# EAGLE design headstage (EAGLE 7.2.0)
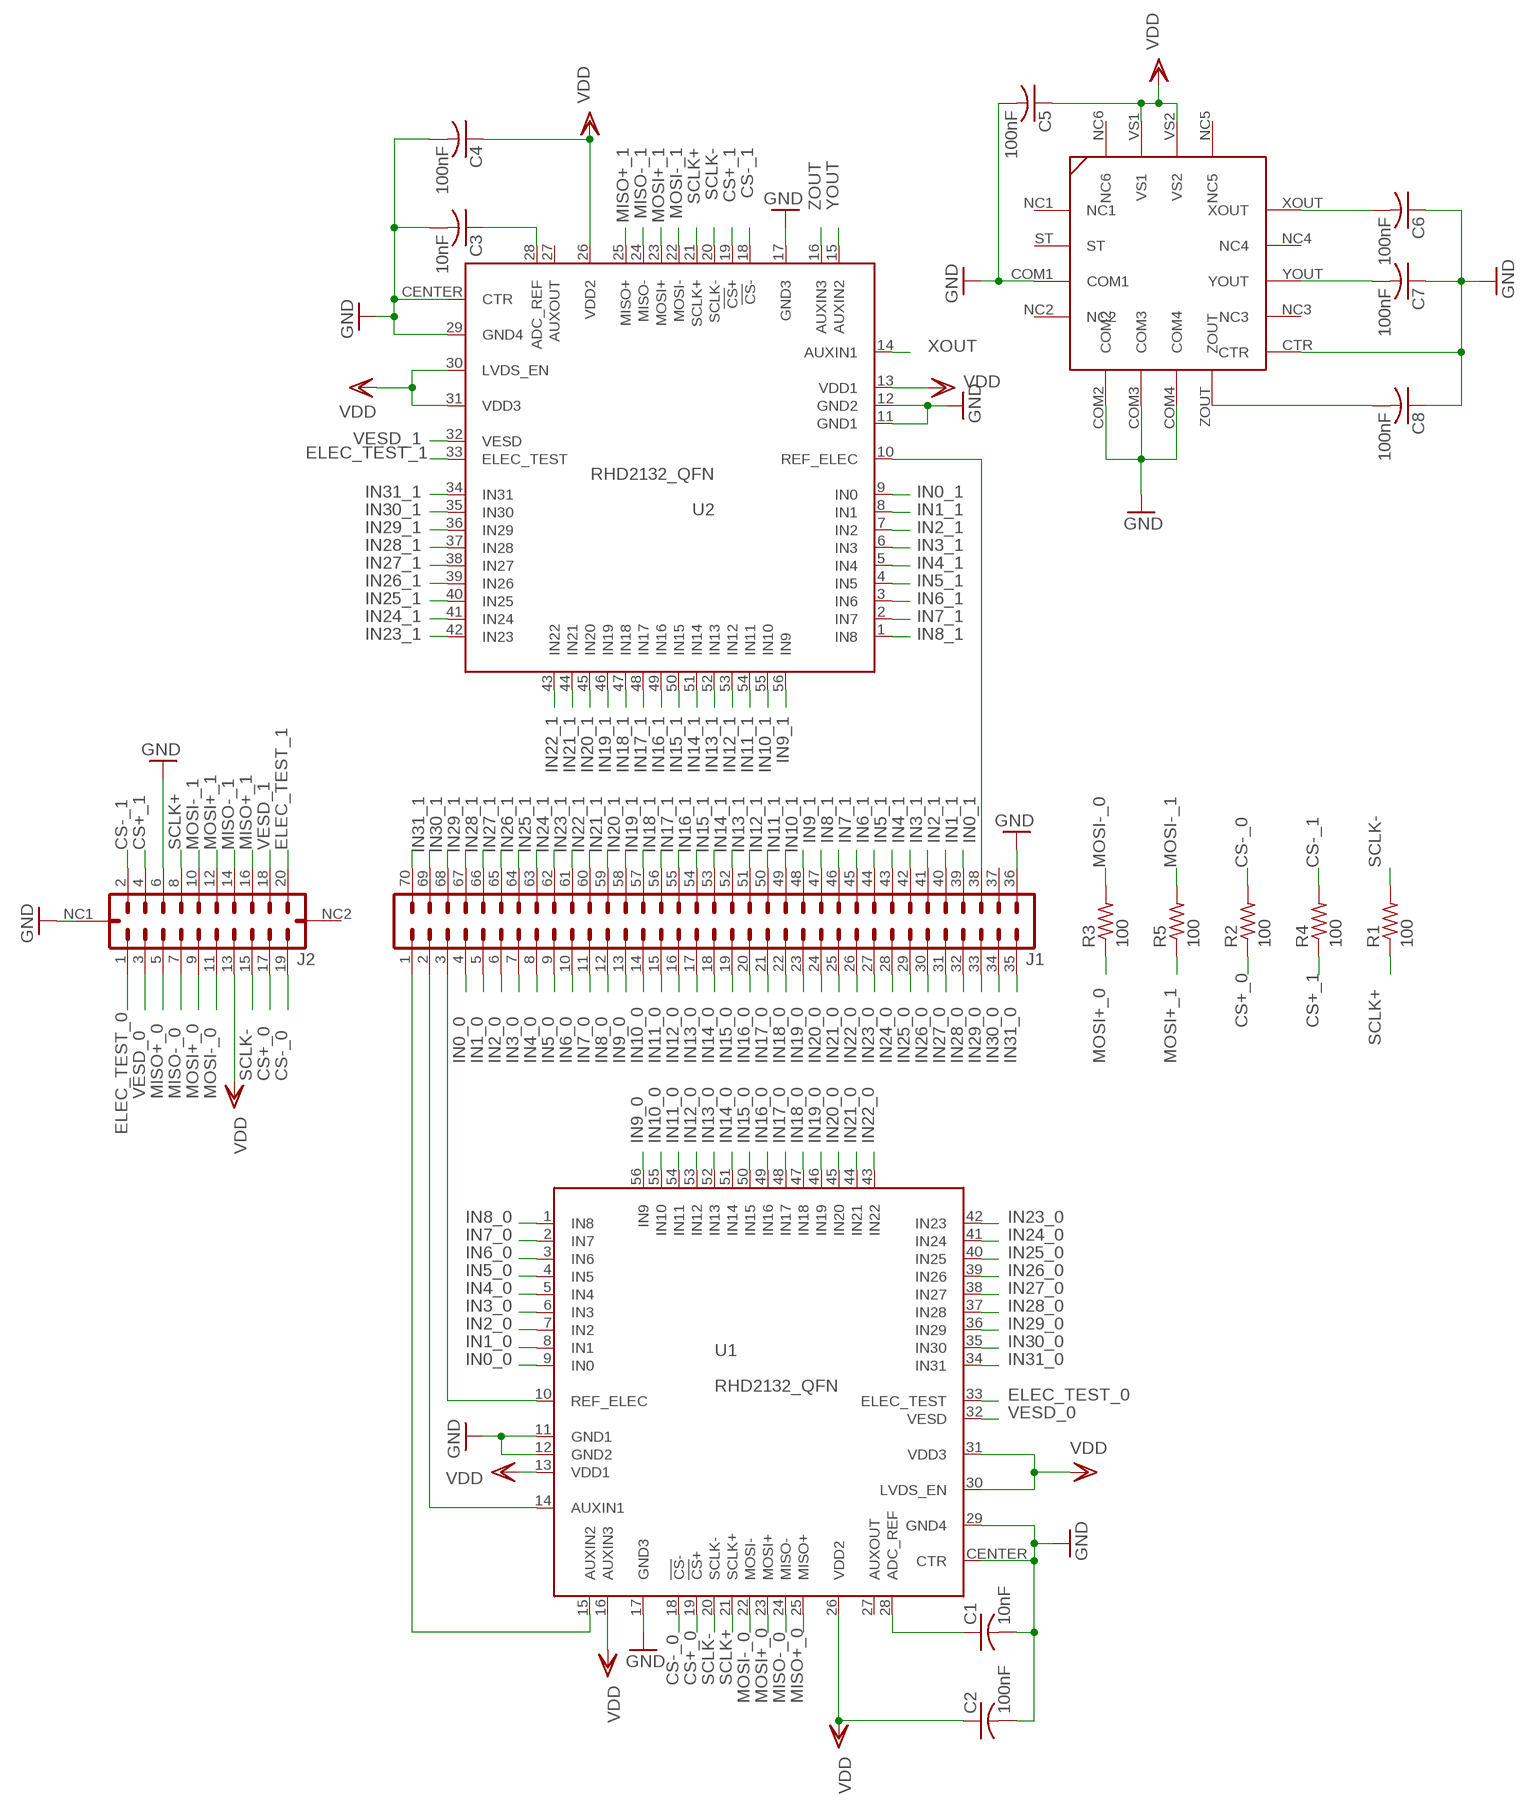
[diagram p0: schematic, sheet 1]

## Parts
C1  10nF  C-USC0402K  [C0402K]
C2  100nF  C-USC0402K  [C0402K]
C3  10nF  C-USC0402K  [C0402K]
C4  100nF  C-USC0402K  [C0402K]
C5  100nF  C-USC0402K  [C0402K]
C6  100nF  C-USC0402K  [C0402K]
C7  100nF  C-USC0402K  [C0402K]
C8  100nF  C-USC0402K  [C0402K]
J1  HIROSE_DF40C-70DS-0.4V(51)  HIROSE_DF40-70DP  [HIROSE_DF40C-70DP]
J2  MOLEX_501190-2017  [MOLEX_501190-2017]
R1  100  R-US_R0402  [R0402]
R2  100  R-US_R0402  [R0402]
R3  100  R-US_R0402  [R0402]
R4  100  R-US_R0402  [R0402]
R5  100  R-US_R0402  [R0402]
U1  RHD2132_QFN  [QFN56_8_X_8_LARGE]
U2  RHD2132_QFN  [QFN56_8_X_8_LARGE]
U3  ADXL335  [ADXL335]

## Nets
CS+_0: J2.17 R2.1 U1.19(!CS!+)
CS+_1: J2.4 R4.1 U2.19(!CS!+)
CS-_0: J2.19 R2.2 U1.18(!CS!-)
CS-_1: J2.2 R4.2 U2.18(!CS!-)
ELEC_TEST_0: J2.1 U1.33(ELEC_TEST)
ELEC_TEST_1: J2.20 U2.33(ELEC_TEST)
GND: C1.2 C2.2 C3.2 C4.2 C5.2 C6.1 C7.1 C8.1 J1.36 J2.6 J2.NC1 U1.11(GND1) U1.12(GND2) U1.17(GND3) U1.29(GND4) U1.CENTER(CTR) U2.11(GND1) U2.12(GND2) U2.17(GND3) U2.29(GND4) U2.CENTER(CTR) U3.COM1 U3.COM2 U3.COM3 U3.COM4 U3.CTR
IN0_0: J1.4 U1.9(IN0)
IN0_1: J1.39 U2.9(IN0)
IN1_0: J1.5 U1.8(IN1)
IN1_1: J1.40 U2.8(IN1)
IN2_0: J1.6 U1.7(IN2)
IN2_1: J1.41 U2.7(IN2)
IN3_0: J1.7 U1.6(IN3)
IN3_1: J1.42 U2.6(IN3)
IN4_0: J1.8 U1.5(IN4)
IN4_1: J1.43 U2.5(IN4)
IN5_0: J1.9 U1.4(IN5)
IN5_1: J1.44 U2.4(IN5)
IN6_0: J1.10 U1.3(IN6)
IN6_1: J1.45 U2.3(IN6)
IN7_0: J1.11 U1.2(IN7)
IN7_1: J1.46 U2.2(IN7)
IN8_0: J1.12 U1.1(IN8)
IN8_1: J1.47 U2.1(IN8)
IN9_0: J1.13 U1.56(IN9)
IN9_1: J1.48 U2.56(IN9)
IN10_0: J1.14 U1.55(IN10)
IN10_1: J1.49 U2.55(IN10)
IN11_0: J1.15 U1.54(IN11)
IN11_1: J1.50 U2.54(IN11)
IN12_0: J1.16 U1.53(IN12)
IN12_1: J1.51 U2.53(IN12)
IN13_0: J1.17 U1.52(IN13)
IN13_1: J1.52 U2.52(IN13)
IN14_0: J1.18 U1.51(IN14)
IN14_1: J1.53 U2.51(IN14)
IN15_0: J1.19 U1.50(IN15)
IN15_1: J1.54 U2.50(IN15)
IN16_0: J1.20 U1.49(IN16)
IN16_1: J1.55 U2.49(IN16)
IN17_0: J1.21 U1.48(IN17)
IN17_1: J1.56 U2.48(IN17)
IN18_0: J1.22 U1.47(IN18)
IN18_1: J1.57 U2.47(IN18)
IN19_0: J1.23 U1.46(IN19)
IN19_1: J1.58 U2.46(IN19)
IN20_0: J1.24 U1.45(IN20)
IN20_1: J1.59 U2.45(IN20)
IN21_0: J1.25 U1.44(IN21)
IN21_1: J1.60 U2.44(IN21)
IN22_0: J1.26 U1.43(IN22)
IN22_1: J1.61 U2.43(IN22)
IN23_0: J1.27 U1.42(IN23)
IN23_1: J1.62 U2.42(IN23)
IN24_0: J1.28 U1.41(IN24)
IN24_1: J1.63 U2.41(IN24)
IN25_0: J1.29 U1.40(IN25)
IN25_1: J1.64 U2.40(IN25)
IN26_0: J1.30 U1.39(IN26)
IN26_1: J1.65 U2.39(IN26)
IN27_0: J1.31 U1.38(IN27)
IN27_1: J1.66 U2.38(IN27)
IN28_0: J1.32 U1.37(IN28)
IN28_1: J1.67 U2.37(IN28)
IN29_0: J1.33 U1.36(IN29)
IN29_1: J1.68 U2.36(IN29)
IN30_0: J1.34 U1.35(IN30)
IN30_1: J1.69 U2.35(IN30)
IN31_0: J1.35 U1.34(IN31)
IN31_1: J1.70 U2.34(IN31)
MISO+_0: J2.5 U1.25(MISO+)
MISO+_1: J2.16 U2.25(MISO+)
MISO-_0: J2.7 U1.24(MISO-)
MISO-_1: J2.14 U2.24(MISO-)
MOSI+_0: J2.9 R3.1 U1.23(MOSI+)
MOSI+_1: J2.12 R5.1 U2.23(MOSI+)
MOSI-_0: J2.11 R3.2 U1.22(MOSI-)
MOSI-_1: J2.10 R5.2 U2.22(MOSI-)
N$1: J1.1 U1.15(AUXIN2)
N$2: J1.2 U1.14(AUXIN1)
N$3: C1.1 U1.28(ADC_REF)
N$6: C3.1 U2.28(ADC_REF)
REF_ELEC_0: J1.3 U1.10(REF_ELEC)
REF_ELEC_1: J1.38 U2.10(REF_ELEC)
SCLK+: J2.8 R1.1 U1.21(SCLK+) U2.21(SCLK+)
SCLK-: J2.15 R1.2 U1.20(SCLK-) U2.20(SCLK-)
VDD: C2.1 C4.1 C5.1 J2.13 U1.13(VDD1) U1.16(AUXIN3) U1.26(VDD2) U1.30(LVDS_EN) U1.31(VDD3) U2.13(VDD1) U2.26(VDD2) U2.30(LVDS_EN) U2.31(VDD3) U3.VS1 U3.VS2
VESD_0: J2.3 U1.32(VESD)
VESD_1: J2.18 U2.32(VESD)
XOUT: C6.2 U2.14(AUXIN1) U3.XOUT
YOUT: C7.2 U2.15(AUXIN2) U3.YOUT
ZOUT: C8.2 U2.16(AUXIN3) U3.ZOUT
Unconnected: J1.37 J2.NC2 U1.27(AUXOUT) U2.27(AUXOUT) U3.NC1 U3.NC2 U3.NC3 U3.NC4 U3.NC5 U3.NC6 U3.ST

## Library data of the parts
C1-C8 = rcl:C-US: CAPACITOR, American symbol
J1 = rpoddar:HIROSE_DF40-70DP
J2 = rpoddar:MOLEX_501190-2017
R1-R5 = rcl:R-US_: RESISTOR, American symbol
U1 U2 = RHD2000:RHD2132
U3 = rpoddar:ADXL335: The ADXL335 is a small, thin, low power, complete 3-axis accelerometer with signal conditioned voltage outputs. The product measures acceleration with a minimum full-scale range of ±3 g. It can measure the static acceleration of gravity in tilt-sensing applications, as well as dynamic acceleration resulting from motion, shock, or vibration. The user selects the bandwidth of the accelerometer using the CX, CY, and CZ capacitors at the XOUT, YOUT, and ZOUT pins. Bandwidths can be selected to suit the application, with a range of 0.5 Hz to 1600 Hz for the X and Y axes, and a range of 0.5 Hz to 550 Hz for the Z axi

## Net classes
0 default: drill 0.203 mm

## Board
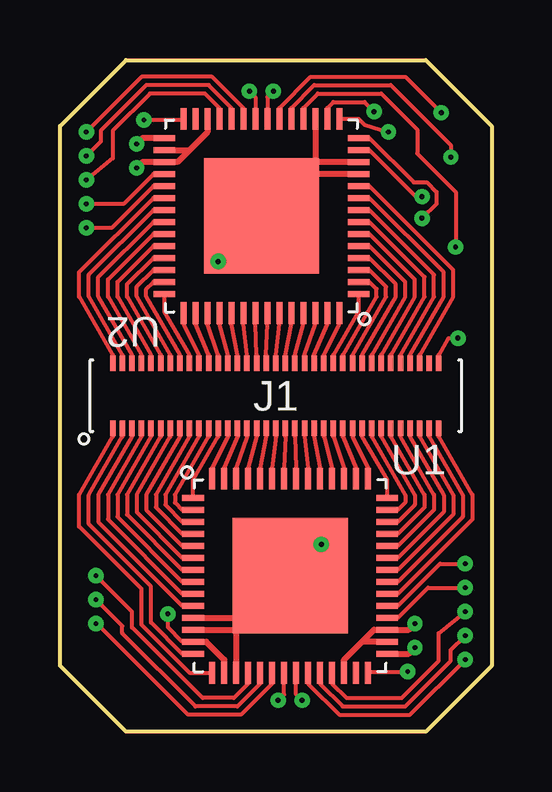
[diagram p1: board, top side]
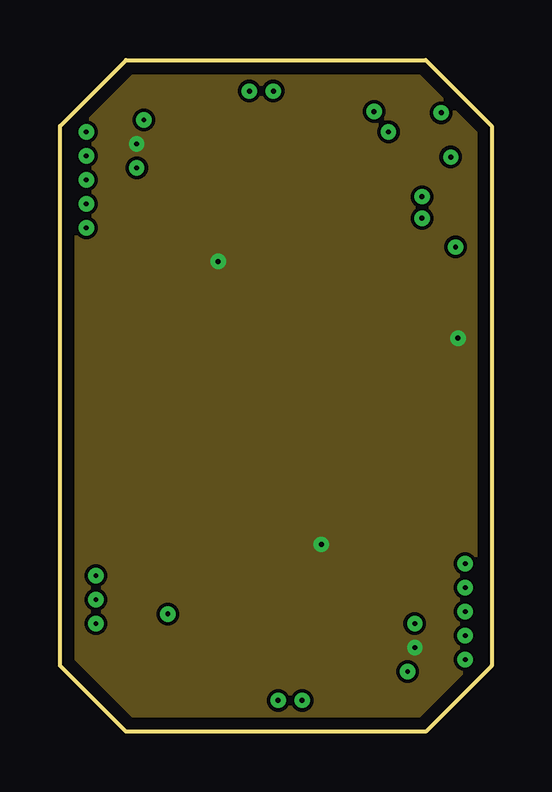
[diagram p2: board, inner layer $GND]
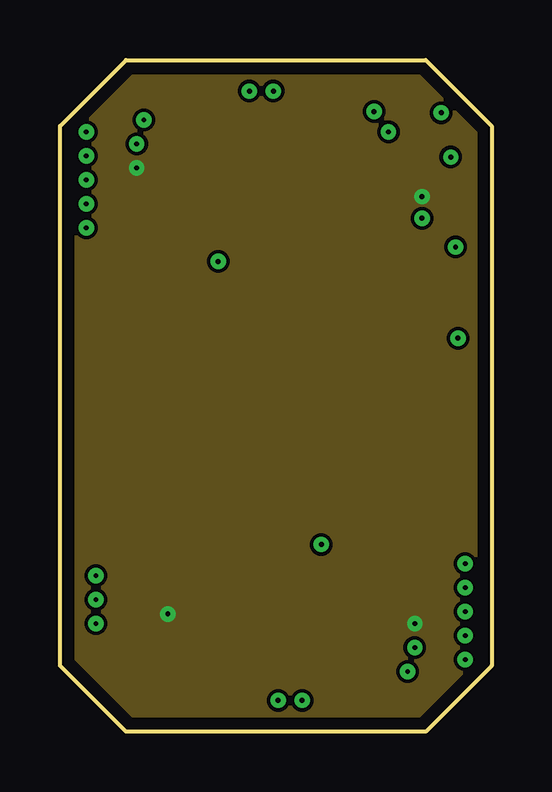
[diagram p3: board, inner layer $VDD]
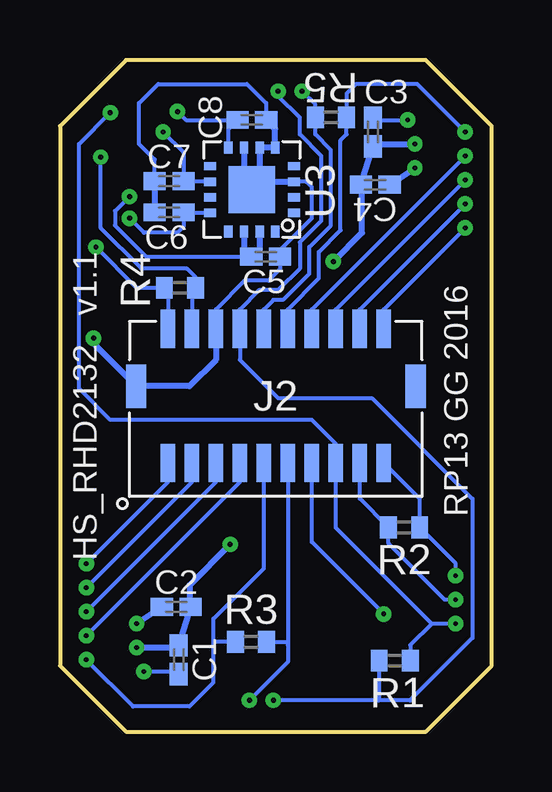
[diagram p4: board, bottom side, seen from below]

Size 18 x 28 mm. Coordinates in mm from the lower left corner, seen from the top.
Outline: 0,2.75 0,25.25 2.75,28 15.25,28 18,25.25 18,2.75 15.25,0 2.75,0 0,2.75
Copper layers (1+2*15+16): Top 0.0178mm / dielectric 12mil / $GND 0.0356mm / dielectric 28mil / $VDD 0.0356mm / dielectric 12mil / Bottom 0.0178mm
Design rules "SSC-EAGLE-4Lyr_v1.0.0.3 *": minimum track width 6mil, minimum drill 8mil, track to track 6mil, track to pad 6mil, pad to pad 6mil, via to via 6mil, smd to smd 6mil, copper to edge 20mil, drill to drill 16mil, minimum pad ring 8mil, minimum via ring 8mil, stop-mask expansion 3mil, vias tented up to drill 0mil, thermal gap 10mil

### Footprints (pad centres in the part's own frame; a part is rotated, then mirrored left to right if it is on the bottom)
C0402K = smd 0.925 x 0.74: 1 -0.6,0; 2 0.6,0
HIROSE_DF40C-70DP = smd 0.23 x 0.66: 1 -6.8,-1.355; 2 -6.4,-1.355; 3 -6,-1.355; 4 -5.6,-1.355; 5 -5.2,-1.355; 6 -4.8,-1.355; 7 -4.4,-1.355; 8 -4,-1.355; 9 -3.6,-1.355; 10 -3.2,-1.355; 11 -2.8,-1.355; 12 -2.4,-1.355; 13 -2,-1.355; 14 -1.6,-1.355; 15 -1.2,-1.355; 16 -0.8,-1.355; 17 -0.4,-1.355; 18 0,-1.355; 19 0.4,-1.355; 20 0.8,-1.355; 21 1.2,-1.355; 22 1.6,-1.355; 23 2,-1.355; 24 2.4,-1.355; 25 2.8,-1.355; 26 3.2,-1.355; 27 3.6,-1.355; 28 4,-1.355; 29 4.4,-1.355; 30 4.8,-1.355; 31 5.2,-1.355; 32 5.6,-1.355; 33 6,-1.355; 34 6.4,-1.355; 35 6.8,-1.355; 36 6.8,1.355; 37 6.4,1.355; 38 6,1.355; 39 5.6,1.355; 40 5.2,1.355; 41 4.8,1.355; 42 4.4,1.355; 43 4,1.355; 44 3.6,1.355; 45 3.2,1.355; 46 2.8,1.355; 47 2.4,1.355; 48 2,1.355; 49 1.6,1.355; 50 1.2,1.355; 51 0.8,1.355; 52 0.4,1.355; 53 0,1.355; 54 -0.4,1.355; 55 -0.8,1.355; 56 -1.2,1.355; 57 -1.6,1.355; 58 -2,1.355; 59 -2.4,1.355; 60 -2.8,1.355; 61 -3.2,1.355; 62 -3.6,1.355; 63 -4,1.355; 64 -4.4,1.355; 65 -4.8,1.355; 66 -5.2,1.355; 67 -5.6,1.355; 68 -6,1.355; 69 -6.4,1.355; 70 -6.8,1.355
MOLEX_501190-2017 = smd 0.6 x 1.6: 1 -4.5,-2.8; 2 -4.5,2.8; 3 -3.5,-2.8; 4 -3.5,2.8; 5 -2.5,-2.8; 6 -2.5,2.8; 7 -1.5,-2.8; 8 -1.5,2.8; 9 -0.5,-2.8; 10 -0.5,2.8; 11 0.5,-2.8; 12 0.5,2.8; 13 1.5,-2.8; 14 1.5,2.8; 15 2.5,-2.8; 16 2.5,2.8; 17 3.5,-2.8; 18 3.5,2.8; 19 4.5,-2.8; 20 4.5,2.8 | smd 0.85 x 1.8: NC1 -5.825,0.4; NC2 5.825,0.4
R0402 = smd 0.7 x 0.9: 1 -0.65,0; 2 0.65,0
QFN56_8_X_8_LARGE = smd 0.9 x 0.25: 1 -4.05,3.25; 2 -4.05,2.75; 3 -4.05,2.25; 4 -4.05,1.75; 5 -4.05,1.25; 6 -4.05,0.75; 7 -4.05,0.25; 8 -4.05,-0.25; 9 -4.05,-0.75; 10 -4.05,-1.25; 11 -4.05,-1.75; 12 -4.05,-2.25; 13 -4.05,-2.75; 14 -4.05,-3.25; 29 4.05,-3.25; 30 4.05,-2.75; 31 4.05,-2.25; 32 4.05,-1.75; 33 4.05,-1.25; 34 4.05,-0.75; 35 4.05,-0.25; 36 4.05,0.25; 37 4.05,0.75; 38 4.05,1.25; 39 4.05,1.75; 40 4.05,2.25; 41 4.05,2.75; 42 4.05,3.25 | smd 0.25 x 0.9: 15 -3.25,-4.05; 16 -2.75,-4.05; 17 -2.25,-4.05; 18 -1.75,-4.05; 19 -1.25,-4.05; 20 -0.75,-4.05; 21 -0.25,-4.05; 22 0.25,-4.05; 23 0.75,-4.05; 24 1.25,-4.05; 25 1.75,-4.05; 26 2.25,-4.05; 27 2.75,-4.05; 28 3.25,-4.05; 43 3.25,4.05; 44 2.75,4.05; 45 2.25,4.05; 46 1.75,4.05; 47 1.25,4.05; 48 0.75,4.05; 49 0.25,4.05; 50 -0.25,4.05; 51 -0.75,4.05; 52 -1.25,4.05; 53 -1.75,4.05; 54 -2.25,4.05; 55 -2.75,4.05; 56 -3.25,4.05 | smd 4.8 x 4.8: CENTER 0,0
ADXL335 = smd 0.5 x 0.35: COM1 -1.75,-0.325; NC1 -1.75,0.975; NC2 -1.75,-0.975; NC3 1.75,-0.975; NC4 1.75,0.325; ST -1.75,0.325; XOUT 1.75,0.975; YOUT 1.75,-0.325 | smd 0.35 x 0.5: COM2 -0.975,-1.75; COM3 -0.325,-1.75; COM4 0.325,-1.75; NC5 0.975,1.75; NC6 -0.975,1.75; VS1 0.325,1.75; VS2 -0.325,1.75; ZOUT 0.975,-1.75 | smd 1.95 x 1.95: CTR 0,0

### Placement (x,y rotation side)
C1  13.05,3 90 bottom
C2  13.15,5.2 0 bottom
C3  4.95,25 270 bottom
C4  4.85,22.8 180 bottom
C5  9.42,19.8 0 bottom
C6  13.45,21.65 0 bottom
C7  13.45,22.95 0 bottom
C8  10,25.5 180 bottom
J1  9,14 0 top
J2  9,14 0 bottom
R1  4.04,2.96 0 bottom
R2  3.65,8.51 0 bottom
R3  10.03,3.74 0 bottom
R4  13,18.5 180 bottom
R5  6.7,25.6 180 bottom
U1  9.6,6.5 0 top
U2  8.4,21.5 180 top
U3  10,22.6 180 bottom

### Tracks (layer width: path | path; a pad name or v marks a point on that pad's centre or on a via)
CS+_0  (via drill 0.2 pad 0.64)
  Top 0.175: U1.19 8.35,2 7.4,1.05 5.65,1.05 2.6,4.1 2.6,4.4 v1.5,5.5
  Bottom 0.175: v1.5,5.5 1.95,5.5 4.3,7.85 R2.1 5.5,9.71 J2.17
CS+_1  (via drill 0.2 pad 0.64)
  Top 0.175: U2.19 9.65,26 10.6,26.95 13.8,26.95 16.3,24.45 v16.3,23.95
  Bottom 0.175: J2.4 12.5,18.35 R4.1 12.35,18.95 12.7,19.3 14.6,19.3 16.3,21 v16.3,23.95
CS-_0  (via drill 0.2 pad 0.64)
  Top 0.175: U1.18 7.85,2 7.25,1.4 5.95,1.4 3,4.34 3,5 v1.5,6.5
  Bottom 0.175: v1.5,6.5 1.5,7.01 R2.2 3,9.7 J2.19
CS-_1  (via drill 0.2 pad 0.64)
  Top 0.175: U2.18 10.15,26 10.75,26.6 13.4,26.6 14.9,25.1 14.9,24.1 16.5,22.5 v16.5,20.2
  Bottom 0.175: J2.2 13.5,18.35 R4.2 14.8,18.5 v16.5,20.2
ELEC_TEST_0  (via drill 0.2 pad 0.64)
  Top 0.175: U1.33 14.1,5.25 15.85,7 v16.9,7
  Bottom 0.175: v16.9,7 13.5,10.4 J2.1
ELEC_TEST_1  (via drill 0.2 pad 0.64)
  Top 0.175: U2.33 3.9,22.75 2.15,21 v1.1,21
  Bottom 0.175: v1.1,21 4.5,17.6 J2.20
GND  (via drill 0.2 pad 0.64)
  Top 0.175: J1.36 15.8,15.7 16.2,16.4 v16.6,16.4
  Top 0.25: U1.11 7.85,4.75 U1.CENTER | U1.12 7.35,4.25 | 7.35,4.25 U1.CENTER | 7.35,4.25 U1.17 | U2.17 10.65,23.75 | U2.12 10.65,23.75 | 10.65,23.75 U2.CENTER | U2.11 10.15,23.25 U2.CENTER | U1.29 14.55,3.25 v14.8,3.5 | U2.29 3.45,24.75 v3.2,24.5 | v10.9,7.8 U1.CENTER | U2.CENTER v6.6,19.6
  Bottom 0.175: C1.2 13.15,3.5 | C3.2 4.85,24.5 | J2.6 11.5,17.6 10.3,18.8 9.3,18.8 8.82,19.28 C5.2 8.82,20.08 7.5,21.4 7.5,22.7 7.72,22.93 U3.COM1 | C7.1 14.05,23.85 14.7,24.5 14.7,26.2 13.9,27 10.2,27 9.4,26.2 C8.1
  Bottom 0.25: 13.15,3.5 v14.8,3.5 | C2.2 C1.2 | 4.85,24.5 v3.2,24.5 | C4.2 C3.2 | J2.6 11.5,15.5 12.6,14.4 J2.NC1 16.6,16.18 v16.6,16.4 | v10.9,7.8 12.6,6.1 12.6,5.2 | v6.6,19.6 5.4,20.8 5.4,22.8 | 10.7,22.5 arc-90 U3.CTR | 9.7,22.9 U3.CTR | C7.1 C6.1 | C8.1 9.03,25.12 U3.COM2 U3.COM3 9.68,22.93 U3.CTR | U3.COM4 10.32,22.93 | 10.32,22.93 U3.CTR | 10.32,22.93 U3.COM1
  pour $GND: 0,0 0,28 18,28 18,0
IN0_0
  Top 0.175: J1.4 3.4,12.3 2,9.87 2,8.85 5.1,5.75 U1.9
IN0_1
  Top 0.175: J1.39 14.6,15.7 16,18.13 16,19.15 12.9,22.25 U2.9
IN1_0
  Top 0.175: J1.5 3.8,12.3 2.4,9.87 2.4,8.95 5.1,6.25 U1.8
IN1_1
  Top 0.175: J1.40 14.2,15.7 15.6,18.13 15.6,19.05 12.9,21.75 U2.8
IN2_0
  Top 0.175: J1.6 4.2,12.3 2.8,9.87 2.8,9.05 5.1,6.75 U1.7
IN2_1
  Top 0.175: J1.41 13.8,15.7 15.2,18.13 15.2,18.95 12.9,21.25 U2.7
IN3_0
  Top 0.175: J1.7 4.6,12.3 3.2,9.87 3.2,9.15 5.1,7.25 U1.6
IN3_1
  Top 0.175: J1.42 13.4,15.7 14.8,18.13 14.8,18.85 12.9,20.75 U2.6
IN4_0
  Top 0.175: J1.8 5,12.3 3.6,9.87 3.6,9.25 5.1,7.75 U1.5
IN4_1
  Top 0.175: J1.43 13,15.7 14.4,18.13 14.4,18.75 12.9,20.25 U2.5
IN5_0
  Top 0.175: J1.9 5.4,12.3 4,9.87 4,9.35 5.1,8.25 U1.4
IN5_1
  Top 0.175: J1.44 12.6,15.7 14,18.13 14,18.65 12.9,19.75 U2.4
IN6_0
  Top 0.175: J1.10 5.8,12.3 4.4,9.87 4.4,9.45 5.1,8.75 U1.3
IN6_1
  Top 0.175: J1.45 12.2,15.7 13.6,18.13 13.6,18.55 12.9,19.25 U2.3
IN7_0
  Top 0.175: J1.11 6.2,12.3 4.8,9.87 4.8,9.55 5.1,9.25 U1.2
IN7_1
  Top 0.175: J1.46 11.8,15.7 13.2,18.13 13.2,18.45 12.9,18.75 U2.2
IN8_0
  Top 0.175: J1.12 6.6,12.3 5.55,10.48 U1.1
IN8_1
  Top 0.175: J1.47 11.4,15.7 12.45,17.52 U2.1
IN9_0
  Top 0.175: J1.13 7,12.3 6.35,11 U1.56
IN9_1
  Top 0.175: J1.48 11,15.7 11.65,17 U2.56
IN10_0
  Top 0.175: J1.14 7.4,12.3 6.85,11 U1.55
IN10_1
  Top 0.175: J1.49 10.6,15.7 11.15,17 U2.55
IN11_0
  Top 0.175: J1.15 7.8,12.3 7.35,11 U1.54
IN11_1
  Top 0.175: J1.50 10.2,15.7 10.65,17 U2.54
IN12_0
  Top 0.175: J1.16 8.2,12.3 7.85,11 U1.53
IN12_1
  Top 0.175: J1.51 9.8,15.7 10.15,17 U2.53
IN13_0
  Top 0.175: J1.17 8.6,12.3 8.35,11 U1.52
IN13_1
  Top 0.175: J1.52 9.4,15.7 9.65,17 U2.52
IN14_0
  Top 0.175: J1.18 9,12.3 8.85,11 U1.51
IN14_1
  Top 0.175: J1.53 9,15.7 9.15,17 U2.51
IN15_0
  Top 0.175: J1.19 9.4,12.3 9.35,11 U1.50
IN15_1
  Top 0.175: J1.54 8.6,15.7 8.65,17 U2.50
IN16_0
  Top 0.175: J1.20 9.8,12.3 9.85,11 U1.49
IN16_1
  Top 0.175: J1.55 8.2,15.7 8.15,17 U2.49
IN17_0
  Top 0.175: J1.21 10.2,12.3 10.35,11 U1.48
IN17_1
  Top 0.175: J1.56 7.8,15.7 7.65,17 U2.48
IN18_0
  Top 0.175: J1.22 10.6,12.3 10.85,11 U1.47
IN18_1
  Top 0.175: J1.57 7.4,15.7 7.15,17 U2.47
IN19_0
  Top 0.175: J1.23 11,12.3 11.35,11 U1.46
IN19_1
  Top 0.175: J1.58 7,15.7 6.65,17 U2.46
IN20_0
  Top 0.175: J1.24 11.4,12.3 11.85,11 U1.45
IN20_1
  Top 0.175: J1.59 6.6,15.7 6.15,17 U2.45
IN21_0
  Top 0.175: J1.25 11.8,12.3 12.35,11 U1.44
IN21_1
  Top 0.175: J1.60 6.2,15.7 5.65,17 U2.44
IN22_0
  Top 0.175: J1.26 12.2,12.3 12.85,11 U1.43
IN22_1
  Top 0.175: J1.61 5.8,15.7 5.15,17 U2.43
IN23_0
  Top 0.175: J1.27 12.6,12.3 13.65,10.48 U1.42
IN23_1
  Top 0.175: J1.62 5.4,15.7 4.35,17.52 U2.42
IN24_0
  Top 0.175: J1.28 13,12.3 14.4,9.87 14.4,9.55 14.1,9.25 U1.41
IN24_1
  Top 0.175: J1.63 5,15.7 3.6,18.13 3.6,18.45 3.9,18.75 U2.41
IN25_0
  Top 0.175: J1.29 13.4,12.3 14.8,9.87 14.8,9.45 14.1,8.75 U1.40
IN25_1
  Top 0.175: J1.64 4.6,15.7 3.2,18.13 3.2,18.55 3.9,19.25 U2.40
IN26_0
  Top 0.175: J1.30 13.8,12.3 15.2,9.87 15.2,9.35 14.1,8.25 U1.39
IN26_1
  Top 0.175: J1.65 4.2,15.7 2.8,18.13 2.8,18.65 3.9,19.75 U2.39
IN27_0
  Top 0.175: J1.31 14.2,12.3 15.6,9.87 15.6,9.25 14.1,7.75 U1.38
IN27_1
  Top 0.175: J1.66 3.8,15.7 2.4,18.13 2.4,18.75 3.9,20.25 U2.38
IN28_0
  Top 0.175: J1.32 14.6,12.3 16,9.87 16,9.15 14.1,7.25 U1.37
IN28_1
  Top 0.175: J1.67 3.4,15.7 2,18.13 2,18.85 3.9,20.75 U2.37
IN29_0
  Top 0.175: J1.33 15,12.3 16.4,9.87 16.4,9.05 14.1,6.75 U1.36
IN29_1
  Top 0.175: J1.68 3,15.7 1.6,18.13 1.6,18.95 3.9,21.25 U2.36
IN30_0
  Top 0.175: J1.34 15.4,12.3 16.8,9.87 16.8,8.95 14.1,6.25 U1.35
IN30_1
  Top 0.175: J1.69 2.6,15.7 1.2,18.13 1.2,19.05 3.9,21.75 U2.35
IN31_0
  Top 0.175: J1.35 15.8,12.3 17.2,9.87 17.2,8.85 14.1,5.75 U1.34
IN31_1
  Top 0.175: J1.70 2.2,15.7 0.8,18.13 0.8,19.15 3.9,22.25 U2.34
MISO+_0  (via drill 0.2 pad 0.64)
  Top 0.175: U1.25 11.35,2 11.95,1.4 14.25,1.4 15.8,2.95 15.8,4.1 v16.9,5
  Bottom 0.175: v16.9,5 11.5,10.4 J2.5
MISO+_1  (via drill 0.2 pad 0.64)
  Top 0.175: U2.25 6.65,26 6.05,26.6 3.75,26.6 2.2,25.05 2.2,23.9 v1.1,23
  Bottom 0.175: v1.1,23 6.5,17.6 J2.16
MISO-_0  (via drill 0.2 pad 0.64)
  Top 0.175: U1.24 10.85,2 11.8,1.05 14.4,1.05 16.3,2.95 16.3,3.4 v16.9,4
  Bottom 0.175: v16.9,4 10.5,10.4 J2.7
MISO-_1  (via drill 0.2 pad 0.64)
  Top 0.175: U2.24 7.15,26 6.2,26.95 3.6,26.95 1.7,25.05 1.7,24.6 v1.1,24
  Bottom 0.175: v1.1,24 7.5,17.6 J2.14
MOSI+_0  (via drill 0.2 pad 0.64)
  Top 0.175: U1.23 10.35,2 11.65,0.7 14.6,0.7 v16.9,3
  Bottom 0.175: v16.9,3 14.95,1.05 12.6,1.05 11.6,2.05 11.6,3.74 | 11.6,3.74 11.6,4.7 9.5,6.8 J2.9 | R3.1 11.6,3.74
MOSI+_1  (via drill 0.2 pad 0.64)
  Top 0.175: U2.23 7.65,26 6.35,27.3 3.4,27.3 v1.1,25
  Bottom 0.175: v1.1,25 3.1,27 5.65,27 6.05,26.6 R5.1 6.05,24.9 6.3,24.65 6.3,20.9 7.2,20 7.2,18.9 8.5,17.6 J2.12
MOSI-_0  (via drill 0.2 pad 0.64)
  Top 0.175: v10.1,1.3 9.85,1.55 U1.22
  Bottom 0.175: J2.11 8.5,3.74 | v10.1,1.3 8.5,2.9 8.5,3.6 8.5,3.74 | R3.2 8.5,3.74
MOSI-_1  (via drill 0.2 pad 0.64)
  Top 0.175: v7.9,26.7 8.15,26.45 U2.22
  Bottom 0.175: v7.9,26.7 7.35,26.15 R5.2 7.35,24.9 6.7,24.25 6.7,21.1 7.6,20.2 7.6,19.1 8.7,18 9.1,18 9.5,17.6 J2.10
N$1
  Top 0.175: J1.1 2.2,12.3 0.8,9.87 0.8,8.55 3.4,5.95 3.4,4.45 5.4,2.45 U1.15
N$2
  Top 0.175: J1.2 2.6,12.3 1.2,9.87 1.2,8.65 3.8,6.05 3.8,4.55 5.1,3.25 U1.14
N$3  (via drill 0.2 pad 0.64)
  Top 0.175: U1.28 12.9,2.5 v14.5,2.5
  Bottom 0.175: C1.1 13.15,2.5 v14.5,2.5
N$6  (via drill 0.2 pad 0.64)
  Top 0.175: U2.28 5.1,25.5 v3.5,25.5
  Bottom 0.175: C3.1 4.85,25.5 v3.5,25.5
REF_ELEC_0
  Top 0.175: J1.3 3,12.3 1.6,9.87 1.6,8.75 5.1,5.25 U1.10
REF_ELEC_1
  Top 0.175: J1.38 15,15.7 16.4,18.13 16.4,19.25 12.9,22.75 U2.10
SCLK+  (via drill 0.2 pad 0.64)
  Top 0.175: v9.1,1.3 9.35,1.55 U1.21 | v8.9,26.7 8.65,26.45 U2.21
  Bottom 0.175: 4.7,1.3 3.4,1.3 0.8,3.9 0.8,9.7 5,13.9 8.9,13.9 10.5,15.5 J2.8 10.5,17.6 9.7,18.4 8.9,18.4 8,19.3 8,20.4 7.1,21.3 7.1,24 8,24.9 8,25.6 8.9,26.5 v8.9,26.7 | 4.7,1.3 v9.1,1.3 | R1.1 4.7,1.3
SCLK-  (via drill 0.2 pad 0.64)
  Top 0.175: U1.20 8.85,2 7.55,0.7 5.35,0.7 1.55,4.5 v1.5,4.5 | U2.20 9.15,26 10.45,27.3 14.4,27.3 v15.9,25.8
  Bottom 0.175: v1.5,4.5 2.5,4.5 | 2.5,4.5 6.5,8.5 J2.15 6.5,12 7.5,13 15.9,13 17.2,14.3 17.2,24.5 v15.9,25.8 | 2.5,4.5 3.39,3.61 R1.2
VDD  (via drill 0.2 pad 0.64)
  Top 0.175: 6.1,3.75 5.1,3.75 4.5,4.35 v4.5,4.9 | U2.13 12.9,24.25 14.85,22.3 v15.1,22.3
  Top 0.25: U1.13 6.1,3.75 6.85,3 U1.16 | U1.26 11.85,3 12.6,3.75 | 12.6,3.75 13.1,4.25 U1.31 14.55,4.25 v14.8,4.5 | U1.30 12.6,3.75 | U2.26 6.15,25 5.4,24.25 | 5.4,24.25 4.9,23.75 U2.31 3.45,23.75 v3.2,23.5 | U2.30 5.4,24.25
  Bottom 0.175: v4.5,4.9 7.5,7.9 J2.13 | v15.1,22.3 15.7,21.7 15.7,21.1 14.4,19.8 C5.1
  Bottom 0.25: C2.1 v14.8,4.5 | C4.1 v3.2,23.5 | U3.VS2 9.68,20.14 C5.1 10.32,20.11 U3.VS1
  pour $VDD: 0,0 0,28 18,28 18,0
VESD_0  (via drill 0.2 pad 0.64)
  Top 0.175: U1.32 14.1,4.75 15.35,6 v16.9,6
  Bottom 0.175: v16.9,6 12.5,10.4 J2.3
VESD_1  (via drill 0.2 pad 0.64)
  Top 0.175: U2.32 3.9,23.25 2.65,22 v1.1,22
  Bottom 0.175: v1.1,22 5.5,17.6 J2.18
XOUT  (via drill 0.2 pad 0.64)
  Top 0.175: U2.14 12.9,24.75 14.75,22.9 15.3,22.9 15.7,22.5 15.7,22 v15.1,21.4
  Bottom 0.175: v15.1,21.4 14.5,20.8 13.1,20.8 12.85,21.05 C6.2 12.82,21.62 U3.XOUT
YOUT  (via drill 0.2 pad 0.64)
  Top 0.175: U2.15 12.45,25.55 12.7,25.3 v13.7,25
  Bottom 0.175: v13.7,25 12.85,24.15 C7.2 12.82,22.93 U3.YOUT
ZOUT  (via drill 0.2 pad 0.64)
  Top 0.175: U2.16 11.15,26 11.4,26.25 12.7,26.25 v13.1,25.85
  Bottom 0.175: v13.1,25.85 12.75,25.5 C8.2 10.97,25.12 U3.ZOUT

### Text on the board
bNames: RP13 GG 2016 | HS_RHD2132 v1.1